# EAGLE design satshakit_fc_power (EAGLE 7.5.0)
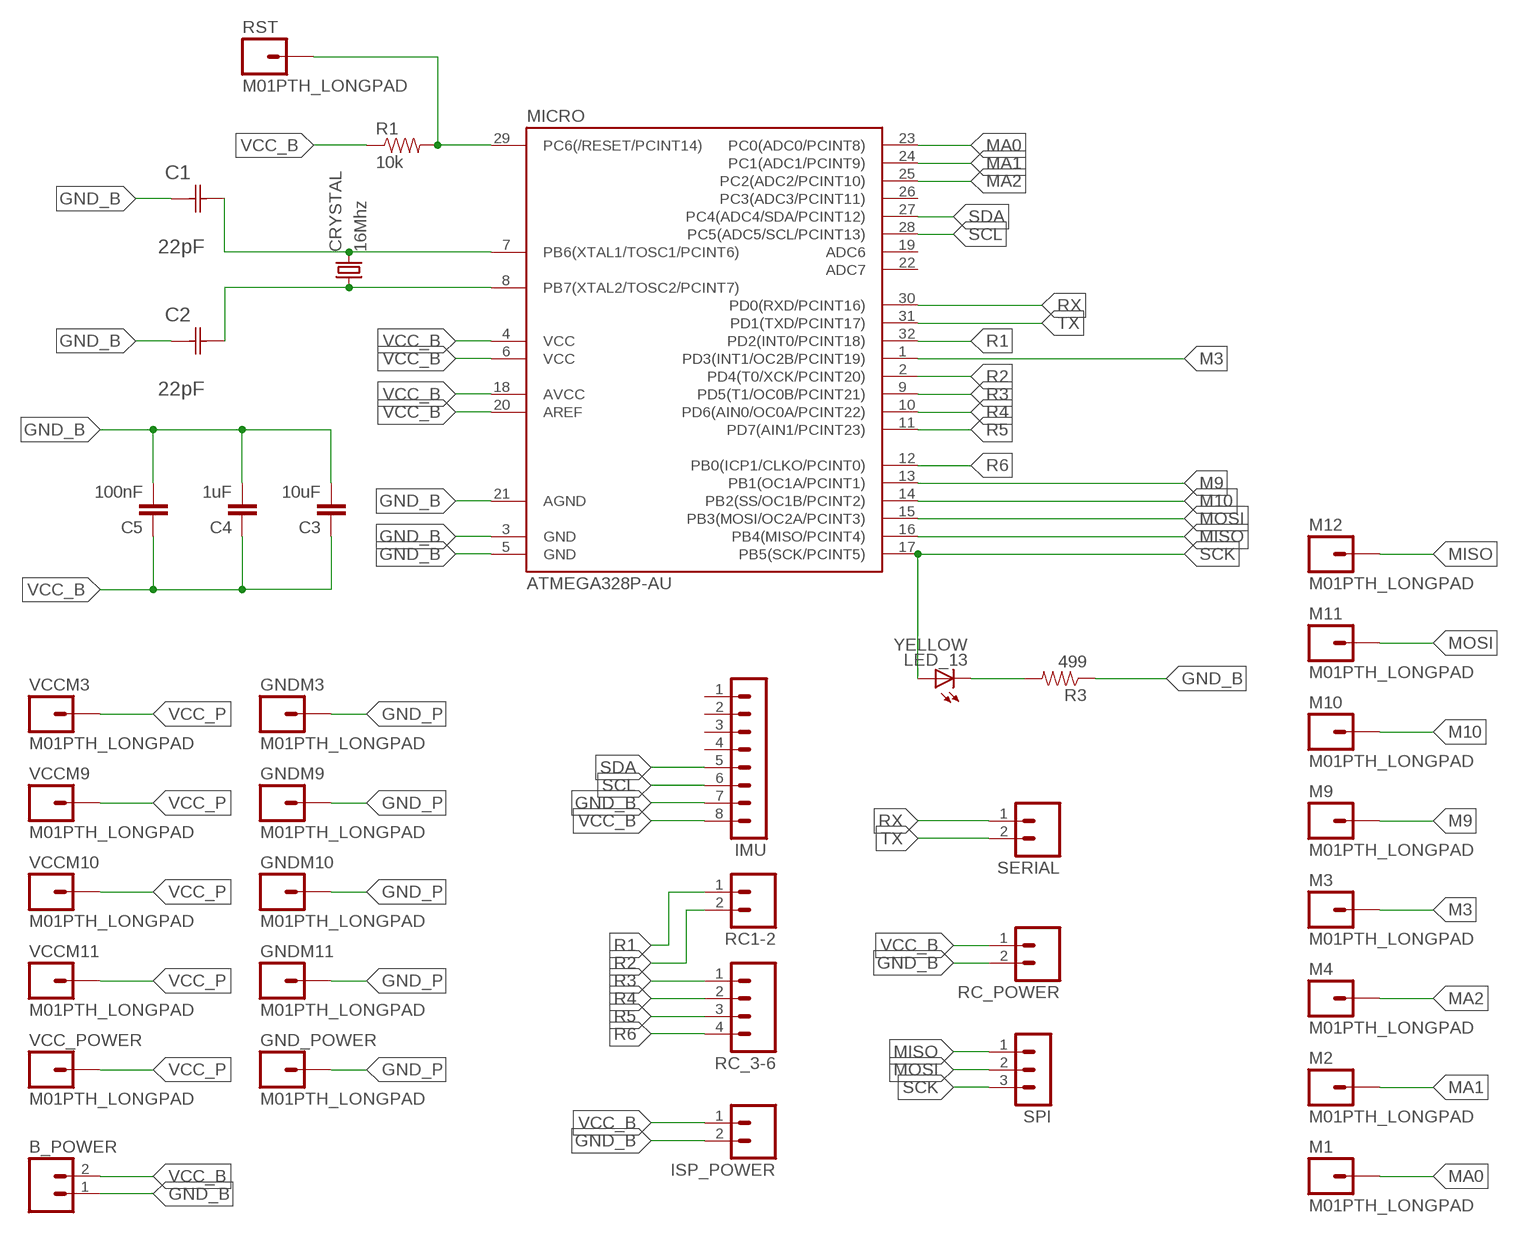
[diagram p0: schematic, sheet 1]

## Parts
B_POWER  M02LOCK_LONGPADS  [1X02_LOCK_LONGPADS]
C1  22pF  0612ZC225MAT2A  [CAPC3216X178N]
C2  22pF  0612ZC225MAT2A  [CAPC3216X178N]
C3  10uF  CAP1206  [1206]
C4  1uF  CAP1206  [1206]
C5  100nF  CAP1206  [1206]
CRYSTAL  16Mhz  CSM-7X-DU  [CSM-7X-DU]
GND_POWER  M01PTH_LONGPAD  [1X01_LONGPAD]
GNDM3  M01PTH_LONGPAD  [1X01_LONGPAD]
GNDM9  M01PTH_LONGPAD  [1X01_LONGPAD]
GNDM10  M01PTH_LONGPAD  [1X01_LONGPAD]
GNDM11  M01PTH_LONGPAD  [1X01_LONGPAD]
IMU  MA08-1  [MA08-1]
ISP_POWER  M02LOCK_LONGPADS  [1X02_LOCK_LONGPADS]
LED_13  YELLOW  LED1206  [1206]
M1  M01PTH_LONGPAD  [1X01_LONGPAD]
M2  M01PTH_LONGPAD  [1X01_LONGPAD]
M3  M01PTH_LONGPAD  [1X01_LONGPAD]
M4  M01PTH_LONGPAD  [1X01_LONGPAD]
M9  M01PTH_LONGPAD  [1X01_LONGPAD]
M10  M01PTH_LONGPAD  [1X01_LONGPAD]
M11  M01PTH_LONGPAD  [1X01_LONGPAD]
M12  M01PTH_LONGPAD  [1X01_LONGPAD]
MICRO  ATMEGA328P-AU  ATMEGA48/88/168-AU  [TQFP32-08]
R1  10k  RESISTOR1206  [1206]
R3  499  RESISTOR1206  [1206]
RC1-2  M02  [02P]
RC_3-6  M04LONGPADS  [1X04_LONGPADS]
RC_POWER  M02LOCK_LONGPADS  [1X02_LOCK_LONGPADS]
RST  M01PTH_LONGPAD  [1X01_LONGPAD]
SERIAL  M02LOCK_LONGPADS  [1X02_LOCK_LONGPADS]
SPI  MA03-1  [MA03-1]
VCC_POWER  M01PTH_LONGPAD  [1X01_LONGPAD]
VCCM3  M01PTH_LONGPAD  [1X01_LONGPAD]
VCCM9  M01PTH_LONGPAD  [1X01_LONGPAD]
VCCM10  M01PTH_LONGPAD  [1X01_LONGPAD]
VCCM11  M01PTH_LONGPAD  [1X01_LONGPAD]

## Nets
GND_B: B_POWER.1 C1.1(C1) C2.1(C1) C3.2 C4.2 C5.2 IMU.7 ISP_POWER.2 MICRO.3(GND) MICRO.5(GND) MICRO.21(AGND) R3.1 RC_POWER.2
GND_P: GND_POWER.1 GNDM3.1 GNDM9.1 GNDM10.1 GNDM11.1
M3: M3.1 MICRO.1(PD3(INT1/OC2B/PCINT19))
M9: M9.1 MICRO.13(PB1(OC1A/PCINT1))
M10: M10.1 MICRO.14(PB2(SS/OC1B/PCINT2))
MA0: M1.1 MICRO.23(PC0(ADC0/PCINT8))
MA1: M2.1 MICRO.24(PC1(ADC1/PCINT9))
MA2: M4.1 MICRO.25(PC2(ADC2/PCINT10))
MISO: M12.1 MICRO.16(PB4(MISO/PCINT4)) SPI.1
MOSI: M11.1 MICRO.15(PB3(MOSI/OC2A/PCINT3)) SPI.2
N$2: C1.2(C2) CRYSTAL.2 MICRO.7(PB6(XTAL1/TOSC1/PCINT6))
N$3: MICRO.29(PC6(/RESET/PCINT14)) R1.2 RST.1
N$9: C2.2(C2) CRYSTAL.1 MICRO.8(PB7(XTAL2/TOSC2/PCINT7))
N$27: LED_13.2(C) R3.2
R1: MICRO.32(PD2(INT0/PCINT18)) RC1-2.1
R2: MICRO.2(PD4(T0/XCK/PCINT20)) RC1-2.2
R3: MICRO.9(PD5(T1/OC0B/PCINT21)) RC_3-6.1
R4: MICRO.10(PD6(AIN0/OC0A/PCINT22)) RC_3-6.2
R5: MICRO.11(PD7(AIN1/PCINT23)) RC_3-6.3
R6: MICRO.12(PB0(ICP1/CLKO/PCINT0)) RC_3-6.4
RX: MICRO.30(PD0(RXD/PCINT16)) SERIAL.1
SCK: LED_13.1(A) MICRO.17(PB5(SCK/PCINT5)) SPI.3
SCL: IMU.6 MICRO.28(PC5(ADC5/SCL/PCINT13))
SDA: IMU.5 MICRO.27(PC4(ADC4/SDA/PCINT12))
TX: MICRO.31(PD1(TXD/PCINT17)) SERIAL.2
VCC_B: B_POWER.2 C3.1 C4.1 C5.1 IMU.8 ISP_POWER.1 MICRO.4(VCC) MICRO.6(VCC) MICRO.18(AVCC) MICRO.20(AREF) R1.1 RC_POWER.1
VCC_P: VCC_POWER.1 VCCM3.1 VCCM9.1 VCCM10.1 VCCM11.1
Unconnected: IMU.1 IMU.2 IMU.3 IMU.4 MICRO.19(ADC6) MICRO.22(ADC7) MICRO.26(PC3(ADC3/PCINT11))

## Library data of the parts
B_POWER ISP_POWER RC_POWER SERIAL = 01_SparkFun:M02: Header 2 Standard 2-pin 0.1" header. Use with straight break away headers (SKU : PRT-00116), right angle break away headers (PRT-00553), swiss pins (PRT-00743), machine pins (PRT-00117), and female headers (PRT-00115). Molex polarized connector foot print use with SKU : PRT-08233 with associated crimp pins and housings.
C1 C2 = AVX_By_element14_Batch_1:0612ZC225MAT2A: Capacitor 1206; MPN: 0612ZC225MAT2A; OC_FARNELL: -; OC_NEWARK: 12N3209; SUPPLIER: AVX; TOLERANCE: ±20%; VALUE: 2.2µF; VOLTAGERATING: 10V
C3-C5 = 01_SparkFun:CAP: Capacitor Standard 0603 ceramic capacitor, and 0.1" leaded capacitor.
CRYSTAL = 01_FAB_Hello:CSM-7X-DU: SMD CRYSTAL Source: www.ecsxtal.com .. Crystal 3.6864MHz CSM_7X_DU.PDF; OC_FARNELL: unknown; OC_NEWARK: unknown
GND_POWER GNDM3 GNDM9-GNDM11 M1-M4 M9-M12 RST VCC_POWER VCCM3 VCCM9-VCCM11 = 01_SparkFun:M01: Header 1 Standard 1-pin 0.1" header. Use with straight break away headers (SKU : PRT-00116), right angle break away headers (PRT-00553), swiss pins (PRT-00743), machine pins (PRT-00117), and female headers (PRT-00115).
IMU = con-lstb:MA08-1: PIN HEADER; OC_FARNELL: unknown; OC_NEWARK: unknown
LED_13 = 01_FAB_Hello:LED
MICRO = atmega8:ATMEGA48/88/168
R1 R3 = 01_SparkFun:RESISTOR: Resistor Basic schematic elements and footprints for 0603, 1206, and PTH 1/10th watt (small) resistors.
RC1-2 = con-amp-quick:M02: AMP QUICK CONNECTOR; OC_FARNELL: unknown; OC_NEWARK: unknown
RC_3-6 = 01_SparkFun:M04: Header 4 Standard 4-pin 0.1" header. Use with straight break away headers (SKU : PRT-00116), right angle break away headers (PRT-00553), swiss pins (PRT-00743), machine pins (PRT-00117), and female headers (PRT-00115). Molex polarized connector foot print use with SKU : PRT-08231 with associated crimp pins and housings.
SPI = con-lstb:MA03-1: PIN HEADER; OC_FARNELL: unknown; OC_NEWARK: unknown

## Board
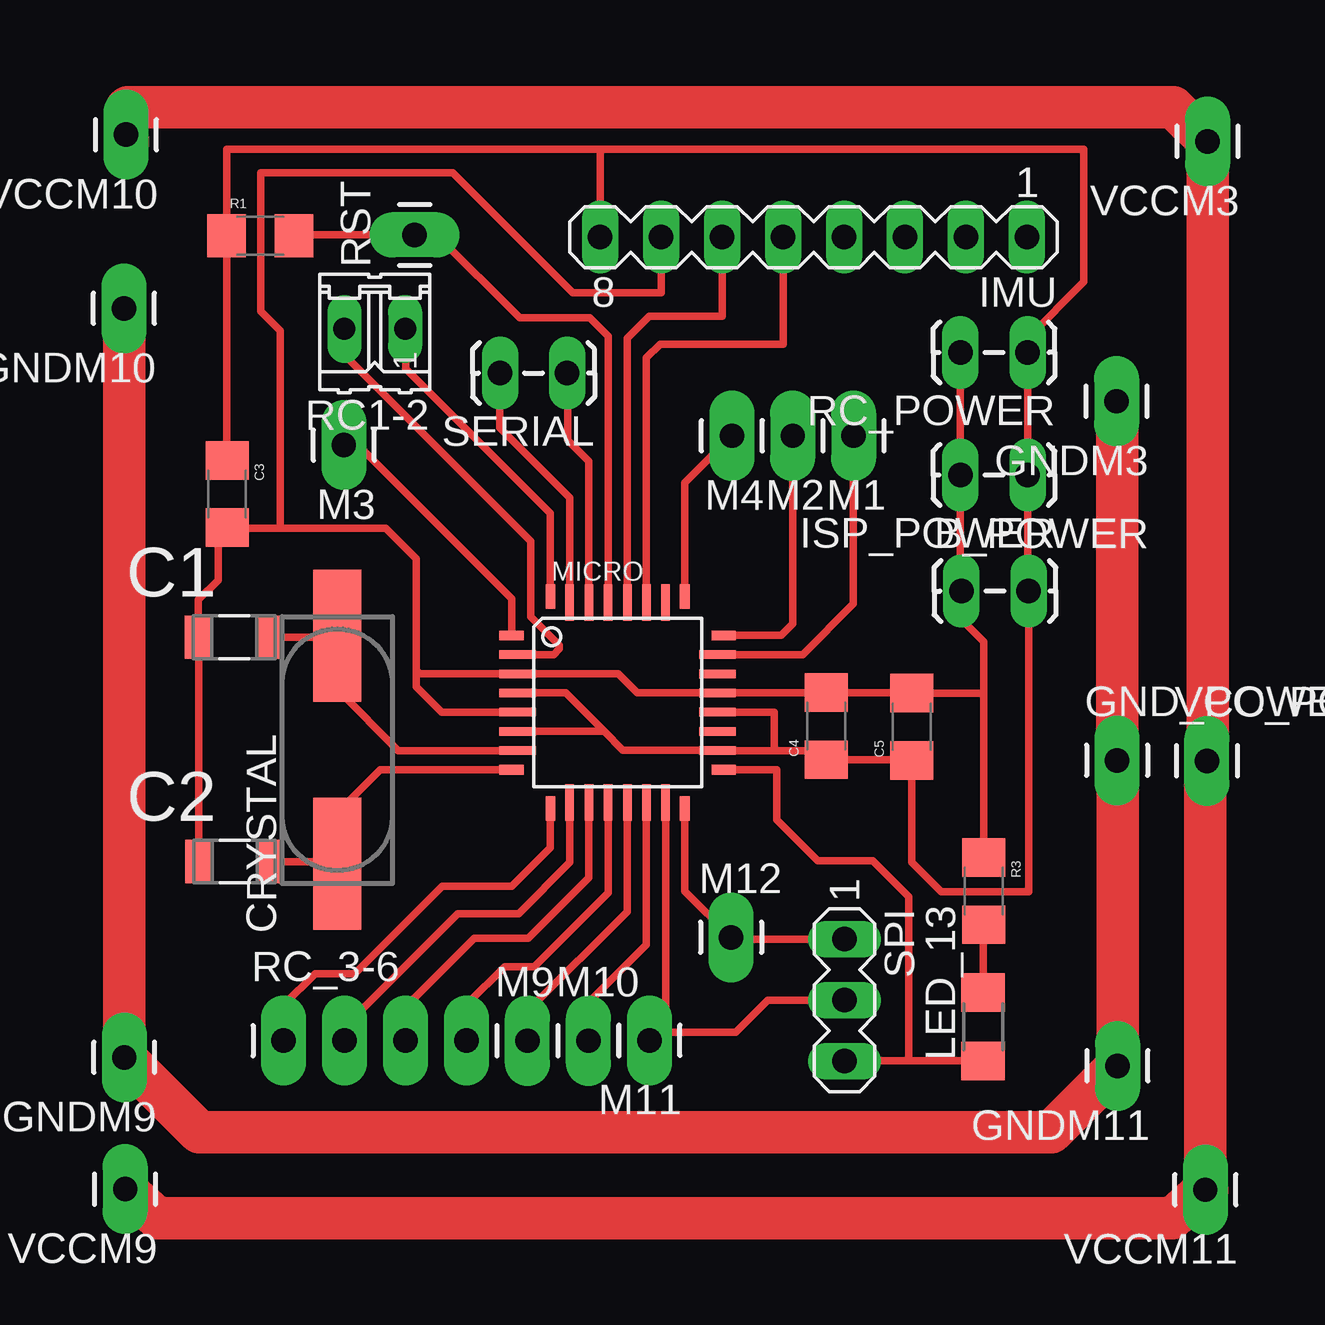
[diagram p1: board, top side]
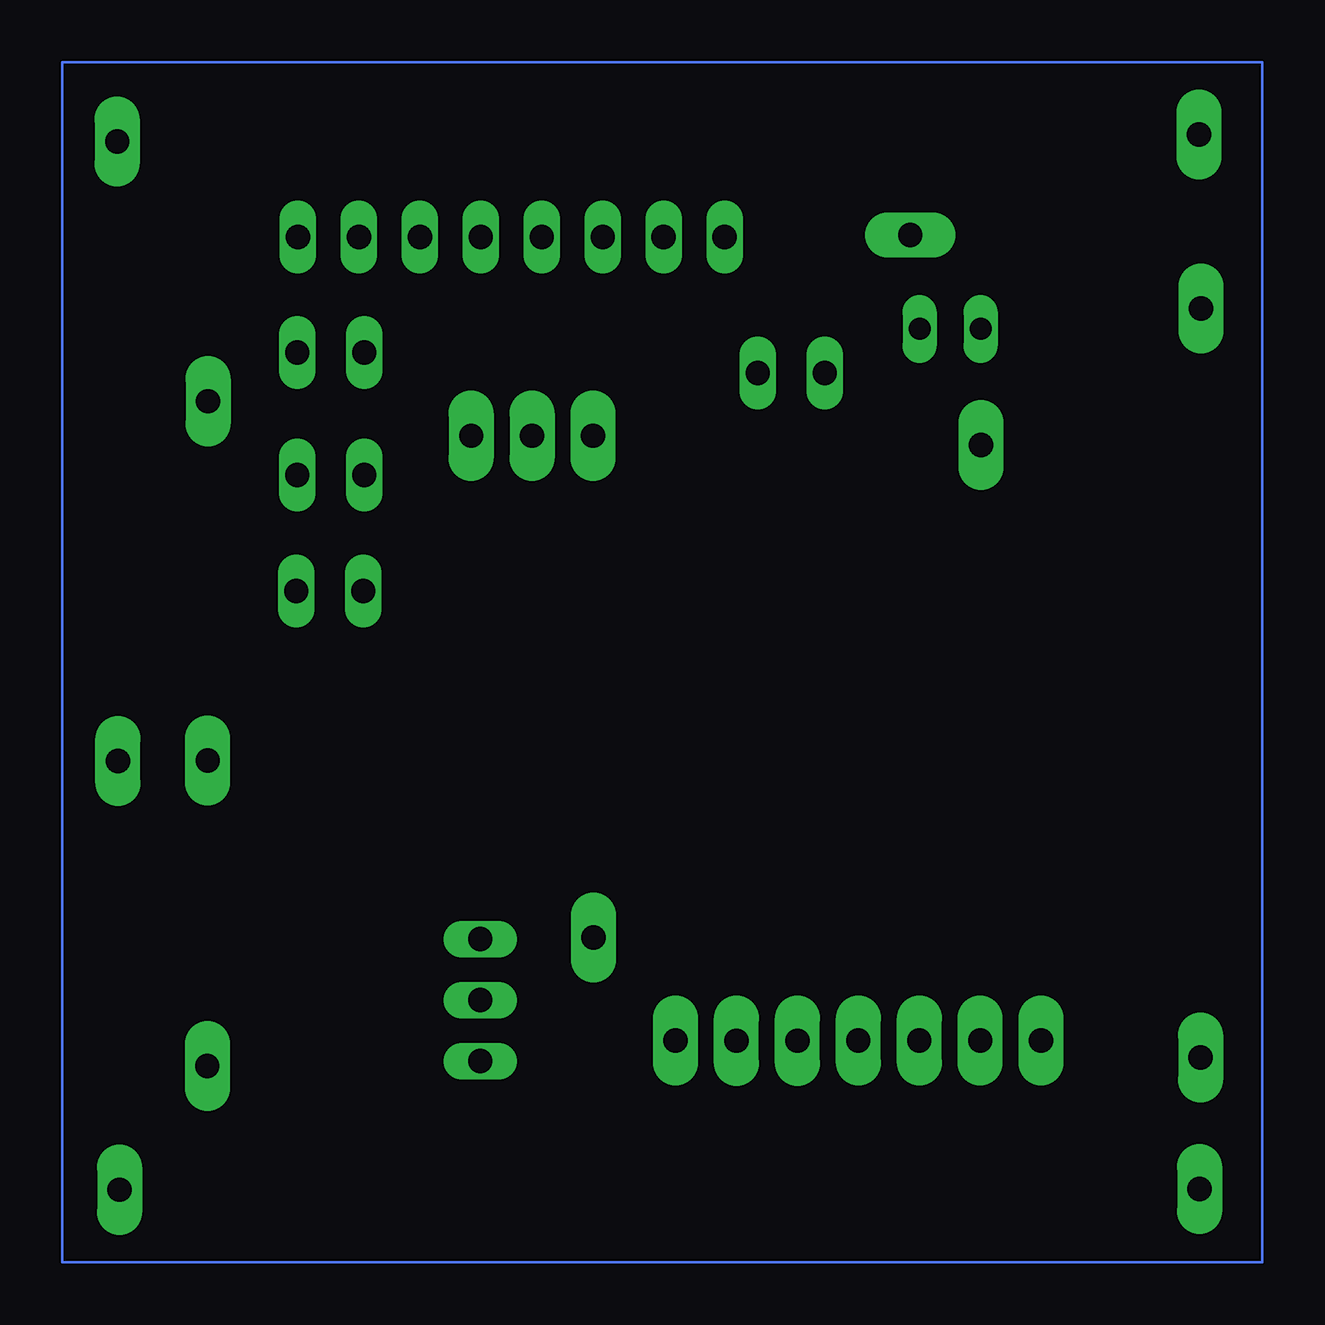
[diagram p2: board, bottom side, seen from below]

No outline drawn. Coordinates in mm, seen from the top.
Copper layers (1*16): Top 0.035mm / dielectric 1.5mm / Bottom 0.035mm
Design rules "default": minimum track width 10mil, minimum drill 24mil, track to track 8mil, track to pad 8mil, pad to pad 8mil, via to via 8mil, smd to smd 8mil, copper to edge 40mil, drill to drill 8mil, minimum pad ring 10mil, minimum via ring 8mil, stop-mask expansion 4mil, vias tented up to drill 0mil, thermal gap 10mil

### Footprints (pad centres in the part's own frame; a part is rotated, then mirrored left to right if it is on the bottom)
1X02_LOCK_LONGPADS = drill 1.016 long: 1 -0.127,0; 2 2.667,0
CAPC3216X178N = smd 1.118 x 1.803: 1 -1.499,0; 2 1.499,0
1206 = smd 1.6 x 1.8: 1 -1.4,0; 2 1.4,0
CSM-7X-DU = smd 5.5 x 2: 1 -4.75,0; 2 4.75,0
1X01_LONGPAD = drill 1.016 pad 1.88 long: 1 0,0
MA08-1 = drill 1.016 long: 1 -8.89,0; 2 -6.35,0; 3 -3.81,0; 4 -1.27,0; 5 1.27,0; 6 3.81,0; 7 6.35,0; 8 8.89,0
1206' = smd 1.6 x 1.803: 1 -1.422,0; 2 1.422,0
TQFP32-08 = smd 1.016 x 0.406: 1 -4.42,2.8; 8 -4.42,-2.8; 17 4.42,-2.8; 24 4.42,2.8 | smd 1.524 x 0.356: 2 -4.166,2; 3 -4.166,1.2; 4 -4.166,0.4; 5 -4.166,-0.4; 6 -4.166,-1.2; 7 -4.166,-2; 18 4.166,-2; 19 4.166,-1.2; 20 4.166,-0.4; 21 4.166,0.4; 22 4.166,1.2; 23 4.166,2 | smd 0.406 x 1.016: 9 -2.8,-4.42; 16 2.8,-4.42; 25 2.8,4.42; 32 -2.8,4.42 | smd 0.356 x 1.524: 10 -2,-4.166; 11 -1.2,-4.166; 12 -0.4,-4.166; 13 0.4,-4.166; 14 1.2,-4.166; 15 2,-4.166; 26 2,4.166; 27 1.2,4.166; 28 0.4,4.166; 29 -0.4,4.166; 30 -1.2,4.166; 31 -2,4.166
02P = drill 0.914 long: 1 -1.27,0; 2 1.27,0
1X04_LONGPADS = drill 1.016 pad 1.88 long: 1 0,0; 2 2.54,0; 3 5.08,0; 4 7.62,0
MA03-1 = drill 1.016 long: 1 -2.54,0; 2 0,0; 3 2.54,0

### Placement (x,y rotation side)
B_POWER  63.59,45.97 0 top
C1  33.16,44.05 0 top
C2  33.18,34.7 0 top
C3  32.86,50.01 270 top
C4  57.83,40.35 90 top
C5  61.38,40.32 90 top
CRYSTAL  37.45,39.36 90 top
GND_POWER  69.94,38.91 0 top
GNDM3  69.93,53.88 180 top
GNDM9  28.58,26.54 180 top
GNDM10  28.56,57.75 180 top
GNDM11  69.96,26.18 180 top
IMU  57.3,60.72 180 top
ISP_POWER  66.09,50.81 180 top
LED_13  YELLOW  [1206']  64.36,27.82 90 top
M1  58.97,52.44 180 top
M2  56.43,52.44 180 top
M3  37.73,52.06 180 top
M4  53.9,52.44 180 top
M9  45.38,27.23 0 top
M10  47.92,27.24 0 top
M11  50.46,27.25 180 top
M12  53.87,31.54 0 top
MICRO  49.14,41.33 0 top
R1  34.24,60.77 0 top
R3  64.39,33.47 270 top
RC1-2  39.01,56.9 180 top
RC_3-6  35.22,27.24 0 top
RC_POWER  66.09,55.92 180 top
RST  40.67,60.81 90 top
SERIAL  46.9,55.06 180 top
SPI  58.59,28.93 270 top
VCC_POWER  73.68,38.9 0 top
VCCM3  73.72,64.71 180 top
VCCM9  28.62,21.06 180 top
VCCM10  28.65,64.99 180 top
VCCM11  73.62,21.03 180 top

### Tracks (layer width: path | path; a pad name or v marks a point on that pad's centre or on a via)
GND_B
  Top 0.305: 64.39,41.72 C5.2 61.38,41.74 C4.2 57.83,41.73 MICRO.21 49.96,41.73 49.17,42.53 MICRO.3 | 64.39,41.72 R3.1 | MICRO.3 42.8,42.53 | MICRO.5 44.97,40.92 41.81,40.92 40.74,41.99 40.74,42.67 | 64.39,41.72 64.39,43.86 63.48,44.78 63.48,45.96 B_POWER.1 63.42,46.01 ISP_POWER.2 RC_POWER.2 | 35.08,48.59 32.89,48.59 | 32.89,48.59 C3.2 | 35.08,48.59 35.08,56.82 34.27,57.63 34.27,63.4 42.27,63.4 47.27,58.4 50.95,58.4 IMU.7 | 40.74,42.67 40.74,47.32 39.47,48.59 35.08,48.59 | MICRO.3 40.89,42.53 40.74,42.67 | C2.1 31.68,44.05 C1.1 31.66,45.61 32.49,46.43 32.49,47.84 32.31,48.01 32.89,48.59
GND_P
  Top 1.778: GNDM10.1 28.58,57.73 GNDM9.1 31.7,23.42 67.2,23.42 GNDM11.1 69.96,38.9 GND_POWER.1 69.94,53.86 GNDM3.1
M3
  Top 0.305: MICRO.1 44.72,45.66 38.43,51.94 37.84,51.94 M3.1
M9
  Top 0.305: MICRO.13 49.54,32.62 45.52,28.6 45.52,27.37 M9.1
M10
  Top 0.305: MICRO.14 50.34,31.23 47.88,28.78 47.88,28.47 47.92,28.43 M10.1
MA0
  Top 0.305: MICRO.23 56.84,43.33 58.95,45.44 58.95,52.43 M1.1
MA1
  Top 0.305: MICRO.24 55.96,44.13 56.44,44.6 M2.1
MA2
  Top 0.305: MICRO.25 51.94,50.48 M4.1
MISO
  Top 0.305: MICRO.16 51.94,33.47 M12.1 53.94,31.47 SPI.1
MOSI
  Top 0.305: SPI.2 55.4,28.93 54.05,27.58 50.79,27.58 M11.1 51.14,27.25 MICRO.15
N$2
  Top 0.305: MICRO.7 40,39.33 37.49,41.83 37.49,44.07 CRYSTAL.2 37.45,44.05 C1.2
N$3
  Top 0.305: R1.2 35.64,60.81 RST.1 41.6,60.81 45.06,57.35 47.98,57.35 48.74,56.6 MICRO.29
N$9
  Top 0.305: C2.2 37.45,34.7 CRYSTAL.1 37.49,34.65 37.49,36.78 39.24,38.53 MICRO.8
N$25
  Bottom 0.1: 26,68 76,68 76,18 26,18 26,68
N$27
  Top 0.305: R3.2 64.36,32.07 LED_13.2
R1
  Top 0.305: MICRO.32 46.34,49.22 40.31,55.24 40.31,56.9 RC1-2.1
R2
  Top 0.305: MICRO.2 46.48,43.33 46.71,43.56 46.71,43.71 45.52,44.91 45.52,48.06 37.77,55.8 37.77,56.9 RC1-2.2
R3
  Top 0.305: MICRO.9 46.34,35.29 44.73,33.68 41.83,33.68 38.18,30.02 36.52,30.02 35.23,28.73 35.23,27.25 RC_3-6.1
R4
  Top 0.305: MICRO.10 47.14,34.66 45.01,32.54 42.47,32.54 38.05,28.12 38.05,27.53 RC_3-6.2
R5
  Top 0.305: MICRO.11 47.94,34.02 45.41,31.5 43.16,31.5 40.46,28.8 40.46,27.41 RC_3-6.3
R6
  Top 0.305: MICRO.12 48.74,33.4 45.67,30.33 44.42,30.33 42.88,28.78 42.88,27.28 RC_3-6.4
RX
  Top 0.305: MICRO.30 47.94,51.38 47.07,52.25 47.07,55.02 SERIAL.1
SCK
  Top 0.305: LED_13.1 61.27,26.39 | 61.27,26.39 SPI.3 | MICRO.17 55.77,38.53 55.77,36.44 57.47,34.74 59.77,34.74 61.27,33.24 61.27,26.39
SCL
  Top 0.305: MICRO.28 49.54,56.51 50.46,57.43 53.49,57.43 IMU.6
SDA
  Top 0.305: MICRO.27 50.34,55.7 50.9,56.26 56.03,56.26 IMU.5 56.06,60.72
TX
  Top 0.305: MICRO.31 47.14,49.87 44.22,52.78 44.22,55.04 SERIAL.2
VCC_B
  Top 0.305: 55.65,39.33 MICRO.18 53.28,39.34 49.35,39.34 48.57,40.13 | 55.65,39.33 57.83,39.33 C4.1 61.36,38.95 C5.1 61.38,34.68 62.61,33.45 66.26,33.45 B_POWER.2 66.22,46.01 ISP_POWER.1 RC_POWER.1 66.22,56.51 68.56,58.85 68.56,64.39 48.41,64.39 | MICRO.20 55.65,40.93 55.65,39.33 | MICRO.6 48.57,40.13 | MICRO.4 46.97,41.73 48.57,40.13 | C3.1 32.84,51.41 R1.1 32.84,64.39 48.41,64.39 | IMU.8 48.41,64.39
VCC_P
  Top 1.778: VCCM9.1 29.96,19.84 72.25,19.84 73.59,21.06 VCCM11.1 73.62,38.9 VCC_POWER.1 73.72,38.9 VCCM3.1 72.29,66.14 28.73,66.14 28.65,66.06 28.65,65.3 28.7,65.25 28.7,64.59 28.73,64.62 28.73,64.77 28.65,64.85 VCCM10.1
  Top 1.93: 73.62,20.98 VCCM11.1